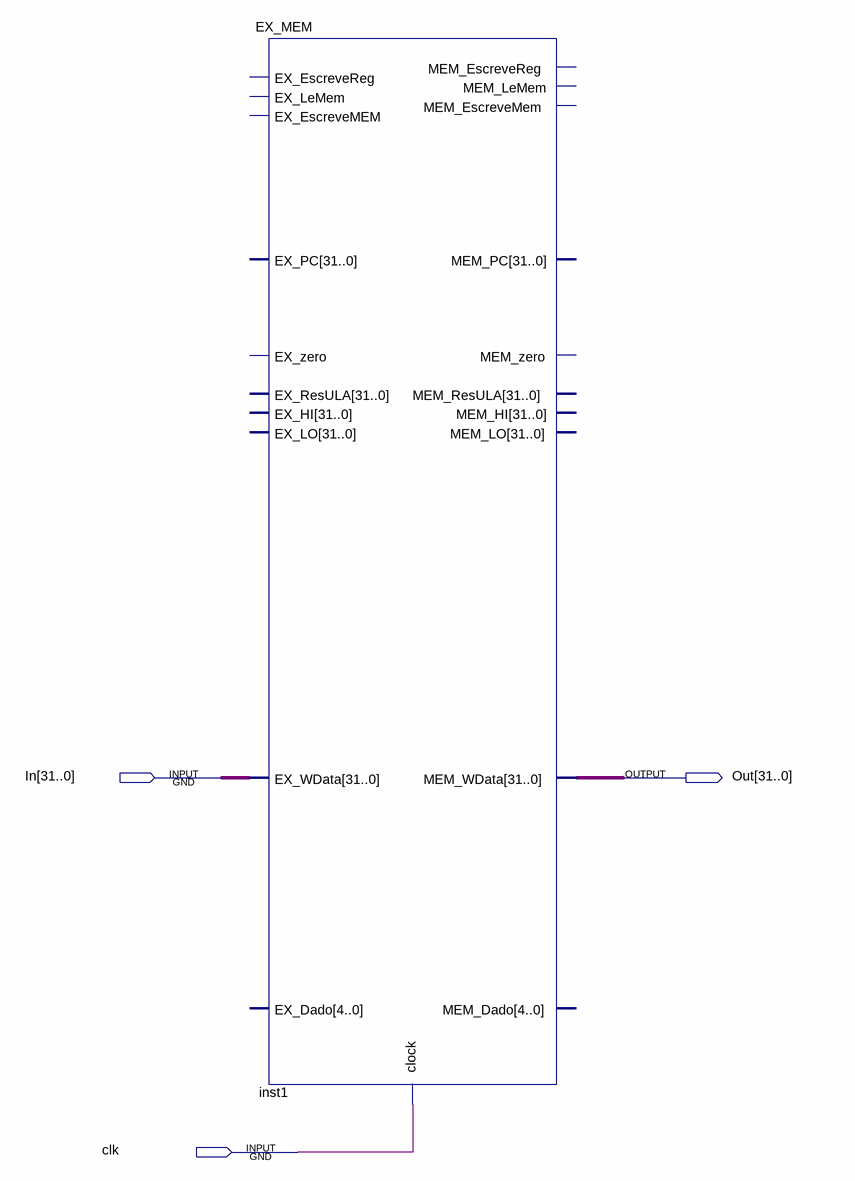
[diagram p0: schematic sheet]
// Quartus schematic aaaaaa.bdf as structural Verilog: 1 symbols, 3 pins
module aaaaaa (
  input  [31:0] In,
  input  clk,
  output [31:0] Out
);

  EX_MEM inst1 (
    .clock(clk), .EX_WData(In), .MEM_WData(Out));  // open: EX_EscreveReg, EX_LeMem, EX_EscreveMEM, EX_zero, EX_PC, EX_ResULA, EX_Dado, EX_HI, EX_LO, MEM_EscreveReg, MEM_LeMem, MEM_EscreveMem, MEM_zero, MEM_PC, MEM_ResULA, MEM_Dado, MEM_HI, MEM_LO
endmodule
